# Altium project Blinkers.PrjPcb
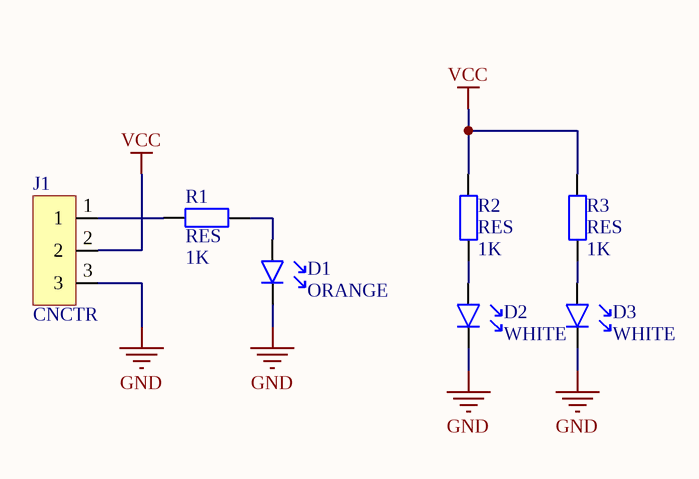
[diagram p0: blinkers.SchDoc]
1 sheet, 7 parts. Net scope: global (net labels, ports and power ports of the same name join across sheets).
Board file: blinkers.PcbDoc

## Sheet blinkers.SchDoc
size A4

### Parts
D1  ORANGE  [RESC1608X06M]
D2  WHITE  [RESC1608X06M]
D3  WHITE  [RESC1608X06M]
J1  CNCTR  [CNCTR_1X3]
R1  RES  value 1K  [RESC1608X06M]
R2  RES  value 1K  [RESC1608X06M]
R3  RES  value 1K  [RESC1608X06M]

### Nets
GND: D1.2(K) D2.2(K) D3.2(K) J1.3
VCC: J1.2 R2.2 R3.2
NetD1_1: D1.1(A1) R1.2
NetD2_1: D2.1(A1) R2.1
NetD3_1: D3.1(A1) R3.1
NetJ1_1: J1.1 R1.1

### Library data of the parts
D1-D3 = LED
J1 = Connector: 3pin connector
R1-R3 = RES: Resistor; Published: 8-Jun-2000; LatestRevisionDate: 17-Jul-2002; LatestRevisionNote: Re-released for DXP Platform.; PackageReference: AXIAL-0.4; Publisher: Altium Limited; PackageDescription: Axial Device, Thru-Hole; 2 Leads; 0.4 in Pin Spacing